# EasyEDA schematic 1-Schematic_ESP32 expandable board.json
TITLE: New Schematic; REV: 1.0; Date: 2018-11-02; Sheet: 1/1; Drawn By: jirka.svitil
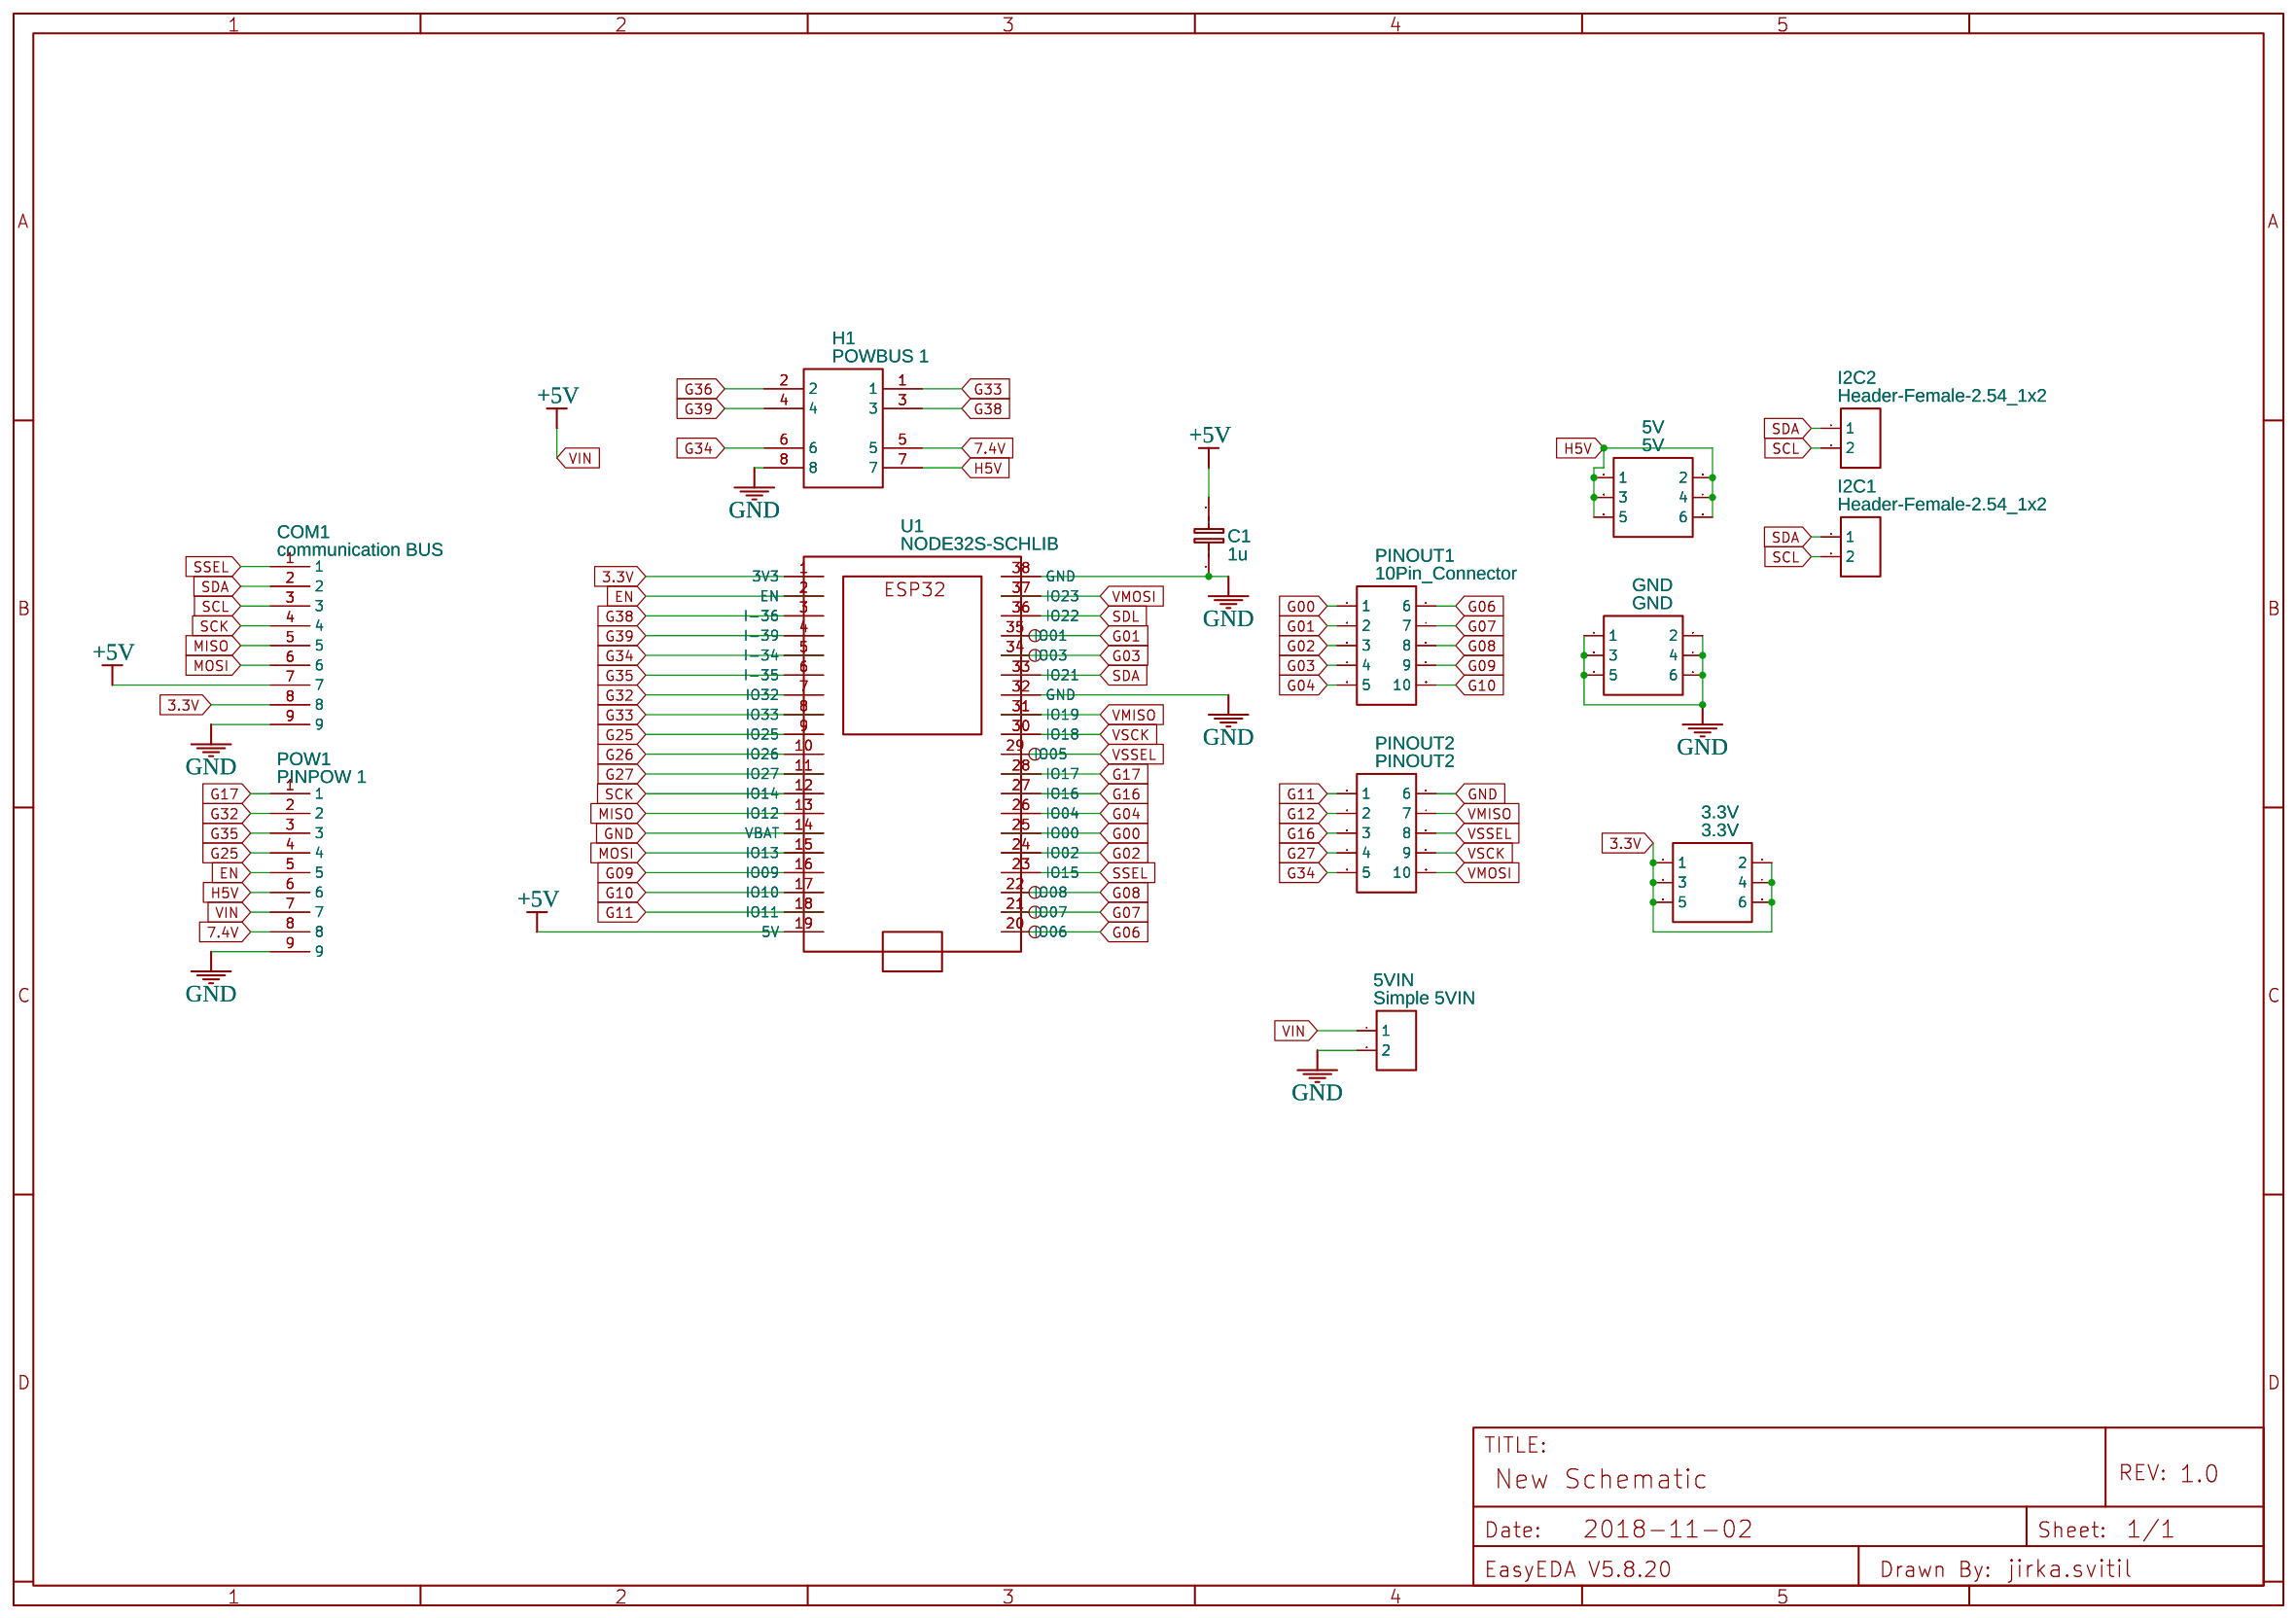
[diagram p0: schematic sheet]

## Parts
3.3V  3.3V  [2X3]
5V  5V  [2X3]
5VIN  Simple 5VIN  [HDR-1X2/2.54]
C1  1u  [RAD-0.1]
COM1  communication BUS  [9PIN HEADER]
GND  GND  [2X3]
H1  POWBUS 1  [HEADER 4X2]
I2C1  Header-Female-2.54_1x2  [HDR-1X2/2.54]
I2C2  Header-Female-2.54_1x2  [HDR-1X2/2.54]
PINOUT1  10Pin_Connector  [2X5]
PINOUT2  PINOUT2  [2X5]
POW1  PINPOW 1  [9PIN HEADER]
U1  NODE32S-SCHLIB  [NODE32S-PCBLIB]

## Library data of the parts
3.3V 5V GND = -: Supplier: LCSC; Manufacturer: BOOMELE; Manufacturer Part: 2X3 2.54mm IDC Box; image: //image.lceda.cn/szlcsc/C11214.jpg; Supplier Part: C11214
5VIN = -: Supplier: LCSC; Manufacturer: BOOMELE; Manufacturer Part: 2.54-1*2PFemale; image: //image.lceda.cn/szlcsc/C49661.jpg; Supplier Part: C49661
C1 = Cap_RAD-0.1_EU: Manufacturer Part: ?
COM1 POW1 = -: Contributor: raptordemon; sourceId: 9RqCAyiSr; Manufacturer Part: ?
H1 = -: Manufacturer Part: Header 4x2; Contributor: MeItIs
I2C1 I2C2 = -: Supplier Part: C49661; Supplier: LCSC; Manufacturer: BOOMELE; Manufacturer Part: 2.54-1*2PFemale; image: //image.lceda.cn/szlcsc/C49661.jpg
PINOUT1 PINOUT2 = -: Manufacturer Part: ?; Contributor: 6Leinad6
U1 = -: Manufacturer Part: New SchematicLib; Contributor: marcos.miasiro

## Nets
3.3V: 3.3V.1 3.3V.2 3.3V.3 3.3V.4 3.3V.5 3.3V.6 COM1.8 U1.1(3V3)
7.4V: H1.5 POW1.8
+5V: 5VIN.1 C1.1 COM1.7 POW1.7 U1.19(5V)
GND: 5VIN.2 C1.2 COM1.9 GND.1 GND.2 GND.3 GND.4 GND.5 GND.6 H1.8 PINOUT2.6 POW1.9 U1.14(VBAT) U1.32(GND) U1.38(GND)
VSSEL: PINOUT2.8 U1.29(IO05)
EN: POW1.5 U1.2(EN)
G00: PINOUT1.1 U1.25(IO00)
G01: PINOUT1.2 U1.35(IO01)
G02: PINOUT1.3 U1.24(IO02)
G03: PINOUT1.4 U1.34(IO03)
G04: PINOUT1.5 U1.26(IO04)
G06: PINOUT1.6 U1.20(IO06)
G07: PINOUT1.7 U1.21(IO07)
G08: PINOUT1.8 U1.22(IO08)
G09: PINOUT1.9 U1.16(IO09)
G10: PINOUT1.10 U1.17(IO10)
G11: PINOUT2.1 U1.18(IO11)
G12: PINOUT2.2
G16: PINOUT2.3 U1.27(IO16)
G17: POW1.1 U1.28(IO17)
G25: POW1.4 U1.9(IO25)
G26: U1.10(IO26)
G27: PINOUT2.4 U1.11(IO27)
G32: POW1.2 U1.7(IO32)
G33: H1.1 U1.8(IO33)
G34: H1.6 PINOUT2.5 U1.5(I-34)
G35: POW1.3 U1.6(I-35)
G36: H1.2
G38: H1.3 U1.3(I-36)
G39: H1.4 U1.4(I-39)
H5V: 5V.1 5V.2 5V.3 5V.4 5V.5 5V.6 H1.7 POW1.6
MISO: COM1.5 U1.13(IO12)
MOSI: COM1.6 U1.15(IO13)
SCK: COM1.4 U1.12(IO14)
SCL: COM1.3 I2C1.2 I2C2.2
SDA: COM1.2 I2C1.1 I2C2.1 U1.33(IO21)
SDL: U1.36(IO22)
SSEL: COM1.1 U1.23(IO15)
VMISO: PINOUT2.7 U1.31(IO19)
VMOSI: PINOUT2.10 U1.37(IO23)
VSCK: PINOUT2.9 U1.30(IO18)
